# Altium schematic sheet 低边开关模块.SchDoc: 低边开关模块
size A4; Author: GAOYANG
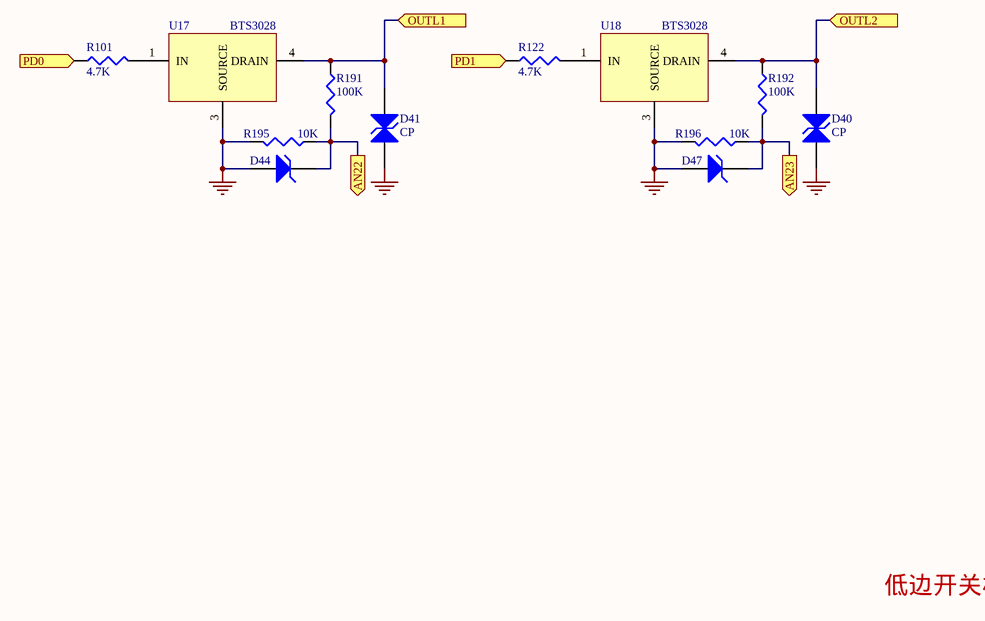
[diagram p0: 低边开关模块.SchDoc]

## Parts
D40  CP  [E52]
D41  CP  [E52]
D44  D Zener  [0805]  (value not drawn)
D47  D Zener  [0805]  (value not drawn)
R101  value 4.7K  [RES1206]  (hidden comment: Res3)
R122  value 4.7K  [RES1206]  (hidden comment: Res3)
R191  value 100K  [0603-L]  (hidden comment: Res3)
R192  value 100K  [0603-L]  (hidden comment: Res3)
R195  value 10K  [0603-L]  (hidden comment: Res3)
R196  value 10K  [0603-L]  (hidden comment: Res3)
U17  BTS3028  [BTS3028]
U18  BTS3028  [BTS3028]

## Ports
AN22 (out), AN23 (out), OUTL1 (in), OUTL2 (in), PD0 (in), PD1 (in)

## Nets
GND: D40.2(A2) D41.2(A2) D44.1(A) D47.1(A) R195.2 R196.2 U17.3(SOURCE) U18.3(SOURCE)
AN22: D44.2(K) R191.2 R195.1 ; port AN22
AN23: D47.2(K) R192.2 R196.1 ; port AN23
OUTL1: D41.1(A1) R191.1 U17.4(DRAIN) ; port OUTL1
OUTL2: D40.1(A1) R192.1 U18.4(DRAIN) ; port OUTL2
PD0: R101.1 ; port PD0
PD1: R122.1 ; port PD1
NetR101_2: R101.2 U17.1(IN)
NetR122_2: R122.2 U18.1(IN)

## Notes on the sheet
- 低边开关模块

## Library data of the parts
D44 D47 = D Zener: Zener Diode; Published: 8-Jun-2000; LatestRevisionDate: 17-Jul-2002; LatestRevisionNote: Re-released for DXP Platform.; PackageReference: DIODE-0.7; Publisher: Altium Limited; PackageDescription: Diode, Thru-Hole; 2 Leads; 0.7 in Pin Spacing
R101 R122 R191 R192 R195 R196 = Res3: Resistor; Published: 8-Jun-2000; LatestRevisionDate: 29-May-2009; LatestRevisionNote: IPC-7351 Footprint Added.; PackageReference: J1-0603; Publisher: Altium Limited; PackageDescription: Chip Resistor
U17 U18 = BTS3028: Smart Low Side Power Switch; Iout: 5A